# Altium schematic sheet MCU.SchDoc
size A3; SheetNumber: 3; SheetTotal: 3
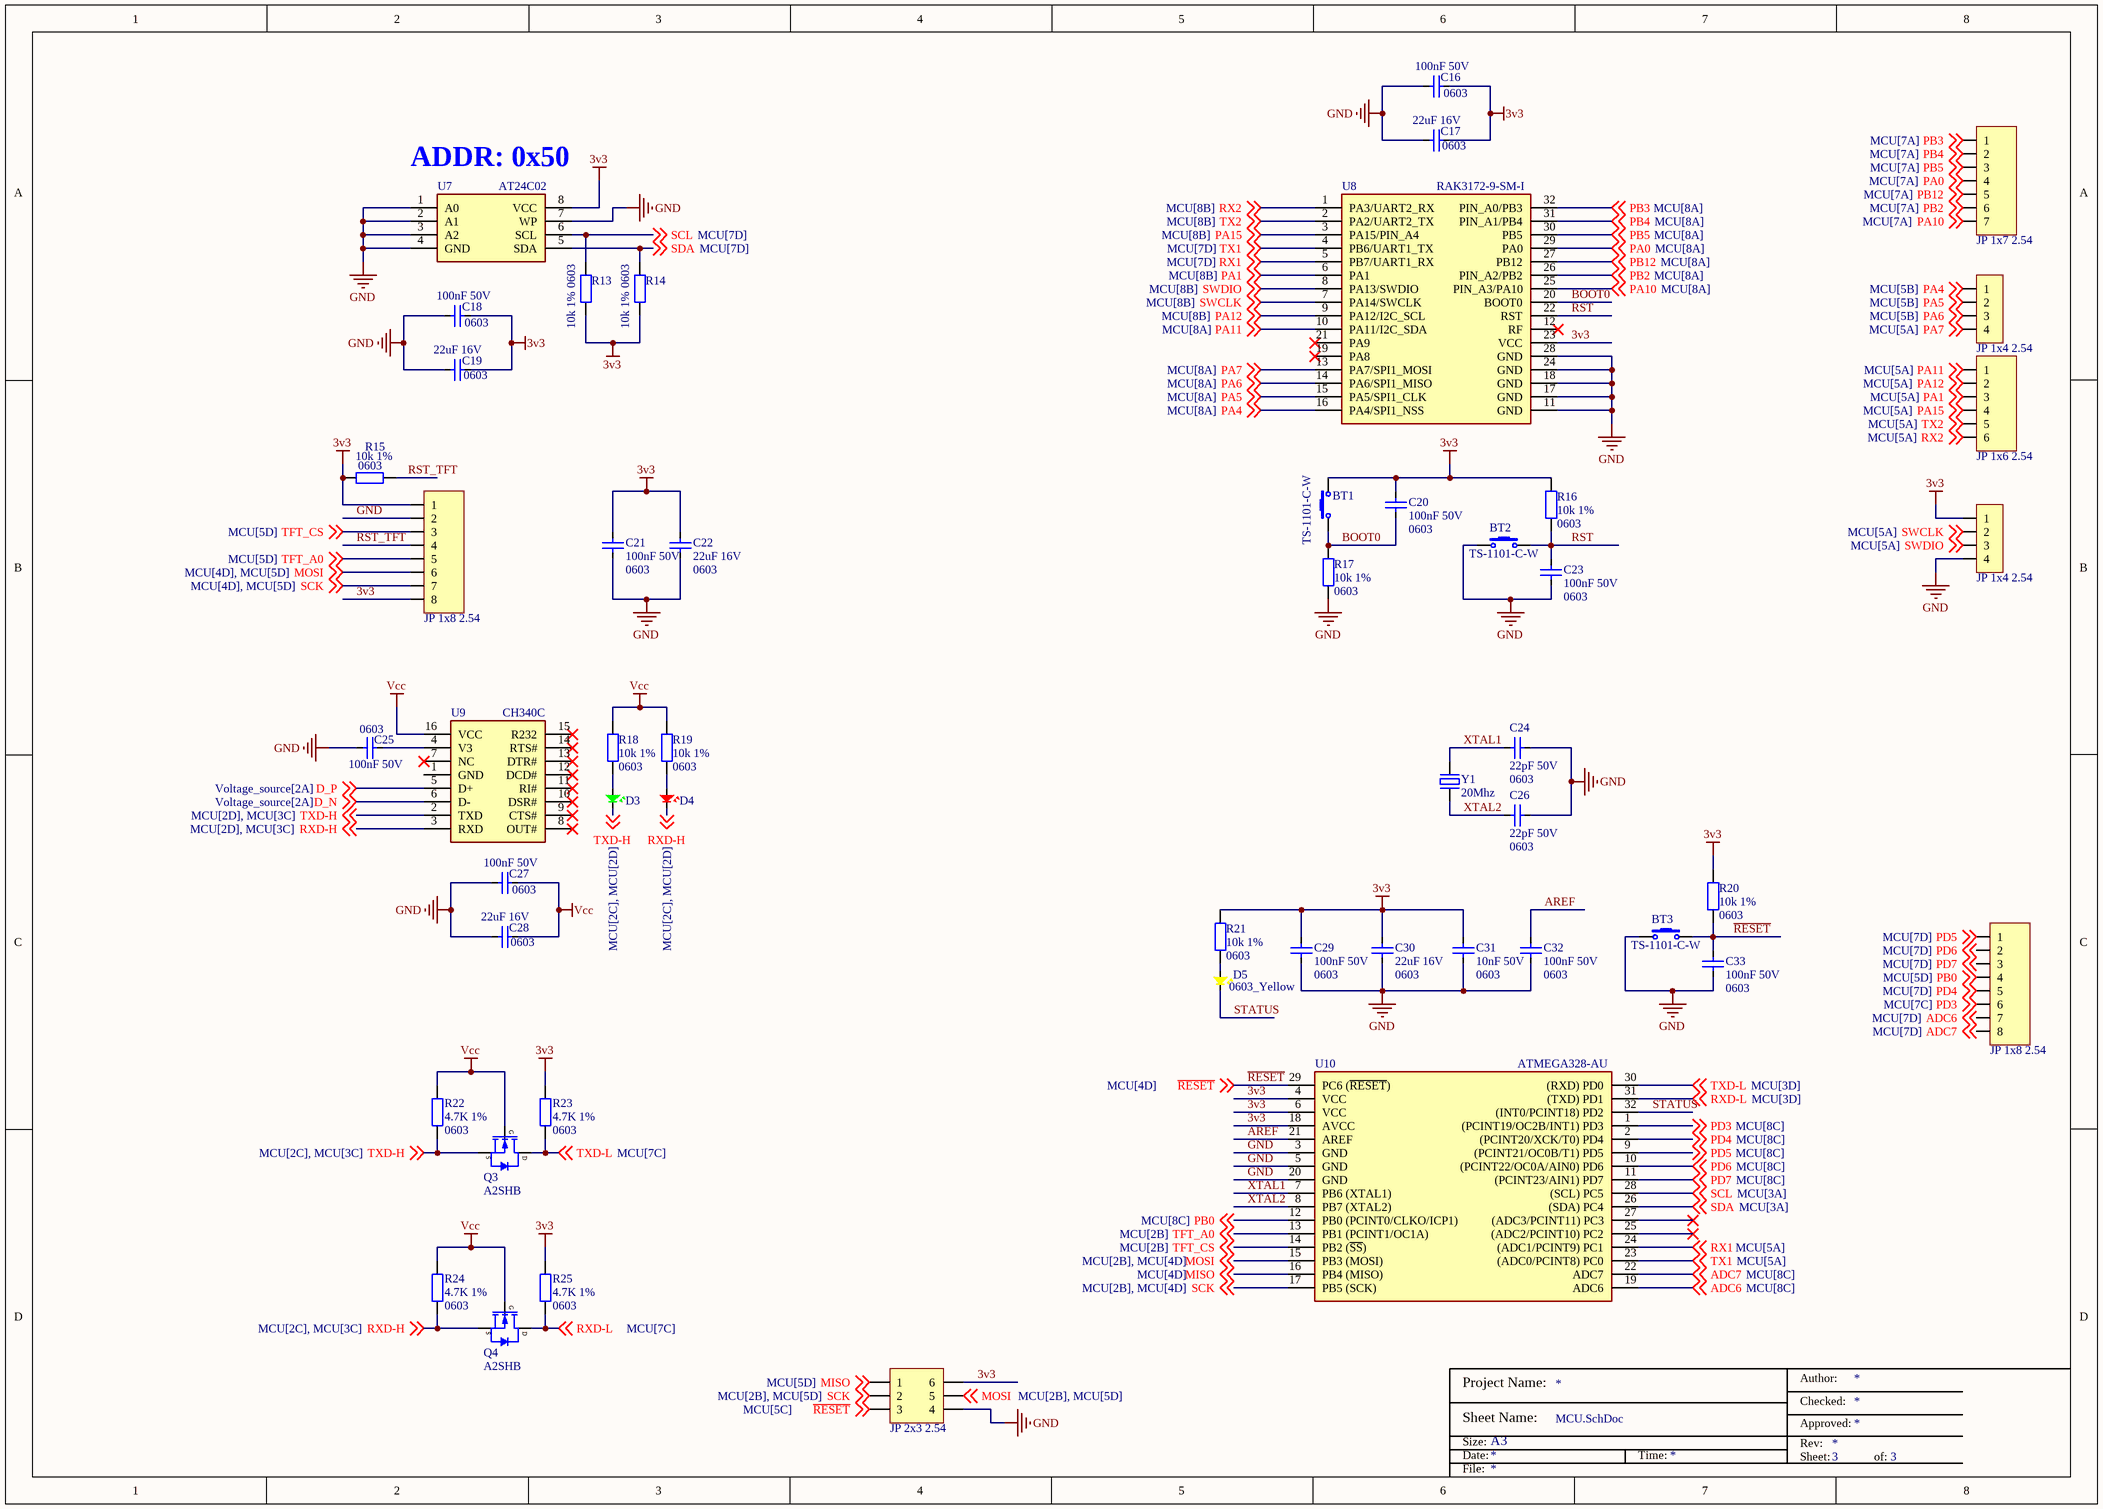
[diagram p0: MCU.SchDoc]

## Parts
BT1  TS-1101-C-W  [button-2P-SMD-6x3x2.5]
BT2  TS-1101-C-W  [button-2P-SMD-6x3x2.5]
BT3  TS-1101-C-W  [button-2P-SMD-6x3x2.5]
C16  100nF 50V  Package: 0603  [C_0603]
C17  22uF 16V  Package: 0603  [C_0603]
C18  100nF 50V  Package: 0603  [C_0603]
C19  22uF 16V  Package: 0603  [C_0603]
C20  100nF 50V  Package: 0603  [C_0603]
C21  100nF 50V  Package: 0603  [C_0603]
C22  22uF 16V  Package: 0603  [C_0603]
C23  100nF 50V  Package: 0603  [C_0603]
C24  22pF 50V  Package: 0603  [C_0603]
C25  100nF 50V  Package: 0603  [C_0603]
C26  22pF 50V  Package: 0603  [C_0603]
C27  100nF 50V  Package: 0603  [C_0603]
C28  22uF 16V  Package: 0603  [C_0603]
C29  100nF 50V  Package: 0603  [C_0603]
C30  22uF 16V  Package: 0603  [C_0603]
C31  10nF 50V  Package: 0603  [C_0603]
C32  100nF 50V  Package: 0603  [C_0603]
C33  100nF 50V  Package: 0603  [C_0603]
D3  0603 GREEN  [LED0603_GREEN]  (value not drawn)
D4  0603 RED  [LED0603_RED]  (value not drawn)
D5  0603_Yellow  [LED0603_YELLOW]
JP2  JP 1x7 2.54  [JP 1x7 CT]
JP3  JP 1x4 2.54  [JP 1x4 CT]
JP4  JP 1x6 2.54  [JP 1x6 CT]
JP5  JP 1x8 2.54  [JP 1x8 CT]
JP6  JP 1x4 2.54  [JP 1x4 CT]
JP7  JP 1x8 2.54  [JP 1x8 CT]
JP8  JP 2x3 2.54  [JP 2x3 DT]
Q3  A2SHB  [SOT23-3]
Q4  A2SHB  [SOT23-3]
R13  10k 1%  Package: 0603  [R_0603]
R14  10k 1%  Package: 0603  [R_0603]
R15  10k 1%  Package: 0603  [R_0603]
R16  10k 1%  Package: 0603  [R_0603]
R17  10k 1%  Package: 0603  [R_0603]
R18  10k 1%  Package: 0603  [R_0603]
R19  10k 1%  Package: 0603  [R_0603]
R20  10k 1%  Package: 0603  [R_0603]
R21  10k 1%  Package: 0603  [R_0603]
R22  4.7K 1%  Package: 0603  [R_0603]
R23  4.7K 1%  Package: 0603  [R_0603]
R24  4.7K 1%  Package: 0603  [R_0603]
R25  4.7K 1%  Package: 0603  [R_0603]
U7  AT24C02  [SOP-8]
U8  RAK3172-9-SM-I  [RAK3172]
U9  CH340C  [CH340C]
U10  ATMEGA328-AU  [TQFP-32(7x7)]
Y1  20Mhz  [HC-49S-SMD]

## Nets
3v3: BT1.2 C16.2 C17.1 C18.2 C19.1 C20.1 C21.2 C22.1 C29.2 C30.1 C31.2 JP5.1 JP5.8 JP6.1 JP8.6 R13.1 R14.1 R15.1 R16.2 R20.2 R21.2 R23.2 R25.2 U7.8(VCC) U8.23(VCC) U10.4(VCC) U10.6(VCC) U10.18(AVCC)
GND: BT2.1 BT3.1 C16.1 C17.2 C18.1 C19.2 C21.1 C22.2 C23.1 C24.1 C25.2 C26.1 C27.1 C28.2 C29.1 C30.2 C31.1 C32.1 C33.1 JP5.2 JP6.4 JP8.4 R17.1 U7.1(A0) U7.2(A1) U7.3(A2) U7.4(GND) U7.7(WP) U8.11(GND) U8.17(GND) U8.18(GND) U8.24(GND) U8.28(GND) U10.3(GND) U10.5(GND) U10.20(GND)
Vcc: C27.2 C28.1 Q3.1(G) Q4.1(G) R18.2 R19.2 R22.2 R24.2 U9.16(VCC)
ADC6: JP7.7 U10.19(ADC6) ; off-sheet ADC6
ADC7: JP7.8 U10.22(ADC7) ; off-sheet ADC7
AREF: C32.2 U10.21(AREF)
BOOT0: BT1.1 C20.2 R17.2 U8.20(BOOT0)
D_N: U9.6(D-) ; off-sheet D_N
D_P: U9.5(D+) ; off-sheet D_P
MISO: JP8.1 U10.16(PB4_(MISO)) ; off-sheet MISO
MOSI: JP5.6 JP8.5 U10.15(PB3_(MOSI)) ; off-sheet MOSI
PA0: JP2.4 U8.29(PA0) ; off-sheet PA0
PA1: JP4.3 U8.6(PA1) ; off-sheet PA1
PA4: JP3.1 U8.16(PA4/SPI1_NSS) ; off-sheet PA4
PA5: JP3.2 U8.15(PA5/SPI1_CLK) ; off-sheet PA5
PA6: JP3.3 U8.14(PA6/SPI1_MISO) ; off-sheet PA6
PA7: JP3.4 U8.13(PA7/SPI1_MOSI) ; off-sheet PA7
PA10: JP2.7 U8.25(PIN_A3/PA10) ; off-sheet PA10
PA11: JP4.1 U8.10(PA11/I2C_SDA) ; off-sheet PA11
PA12: JP4.2 U8.9(PA12/I2C_SCL) ; off-sheet PA12
PA15: JP4.4 U8.3(PA15/PIN_A4) ; off-sheet PA15
PB0: JP7.4 U10.12(PB0_(PCINT0/CLKO/ICP1)) ; off-sheet PB0
PB2: JP2.6 U8.26(PIN_A2/PB2) ; off-sheet PB2
PB3: JP2.1 U8.32(PIN_A0/PB3) ; off-sheet PB3
PB4: JP2.2 U8.31(PIN_A1/PB4) ; off-sheet PB4
PB5: JP2.3 U8.30(PB5) ; off-sheet PB5
PB12: JP2.5 U8.27(PB12) ; off-sheet PB12
PD3: JP7.6 U10.1((PCINT19/OC2B/INT1)_PD3) ; off-sheet PD3
PD4: JP7.5 U10.2((PCINT20/XCK/T0)_PD4) ; off-sheet PD4
PD5: JP7.1 U10.9((PCINT21/OC0B/T1)_PD5) ; off-sheet PD5
PD6: JP7.2 U10.10((PCINT22/OC0A/AIN0)_PD6) ; off-sheet PD6
PD7: JP7.3 U10.11((PCINT23/AIN1)_PD7) ; off-sheet PD7
~{RESET}: BT3.2 C33.2 JP8.3 R20.1 U10.29(PC6_(~{RESET})) ; off-sheet ~{RESET}
RST: BT2.2 C23.2 R16.1 U8.22(RST)
RST_TFT: JP5.4 R15.2
RX1: U8.5(PB7/UART1_RX) U10.24((ADC1/PCINT9)_PC1) ; off-sheet RX1
RX2: JP4.6 U8.1(PA3/UART2_RX) ; off-sheet RX2
RXD-H: D4.2 Q4.2(S) R24.1 U9.3(RXD) ; off-sheet RXD-H
RXD-L: Q4.3(D) R25.1 U10.31((TXD)_PD1) ; off-sheet RXD-L
SCK: JP5.7 JP8.2 U10.17(PB5_(SCK)) ; off-sheet SCK
SCL: R13.2 U7.6(SCL) U10.28((SCL)_PC5) ; off-sheet SCL
SDA: R14.2 U7.5(SDA) U10.26((SDA)_PC4) ; off-sheet SDA
STATUS: D5.2 U10.32((INT0/PCINT18)_PD2)
SWCLK: JP6.2 U8.7(PA14/SWCLK) ; off-sheet SWCLK
SWDIO: JP6.3 U8.8(PA13/SWDIO) ; off-sheet SWDIO
TFT_A0: JP5.5 U10.13(PB1_(PCINT1/OC1A)) ; off-sheet TFT_A0
TFT_CS: JP5.3 U10.14(PB2_(~{SS})) ; off-sheet TFT_CS
TX1: U8.4(PB6/UART1_TX) U10.23((ADC0/PCINT8)_PC0) ; off-sheet TX1
TX2: JP4.5 U8.2(PA2/UART2_TX) ; off-sheet TX2
TXD-H: D3.2 Q3.2(S) R22.1 U9.2(TXD) ; off-sheet TXD-H
TXD-L: Q3.3(D) R23.1 U10.30((RXD)_PD0) ; off-sheet TXD-L
XTAL1: C24.2 U10.7(PB6_(XTAL1)) Y1.2
XTAL2: C26.2 U10.8(PB7_(XTAL2)) Y1.1
NetC25_1: C25.1 U9.4(V3)
NetD3_1: D3.1 R18.1
NetD4_1: D4.1 R19.1
NetD5_1: D5.1 R21.1

Not connected (* = marked no-connect by the designer): U8 12(RF)* 19(PA8)* 21(PA9)*; U9 1(GND) 7(NC)* 8(OUT#)* 9(CTS#)* 10(DSR#)* 11(RI#)* 12(DCD#)* 13(DTR#)* 14(RTS#)* 15(R232)*; U10 25((ADC2/PCINT10)_PC2)* 27((ADC3/PCINT11)_PC3)*

## Notes on the sheet
- (near U7) ADDR: 0x50
- Project Name:
- Author:
- Size:
- Date:
- Sheet Name:
- A3
- Time:
- Checked:
- Approved:
- Rev:
- Sheet:
- of:
- File:

## Library data of the parts
BT1-BT3 = Button-2P: No Without Bracket 50mA 6mm 50,000 Cycles 2.6N 12V 3.6mm 2.5mm Rectangular Button Surface Mount,Vertical SPST SMD Tactile Switches ROHS; Manufacturer: XKB Connection; LCSC Part: C318938; Link: https://www.lcsc.com/product-detail/C318938.html?s_z=n_tactile%2520button; Mrf.Part: TS-1101-C-W; Package: SMD6x3.6x2.5
C16 C18 C20 C21 C23 C25 C27 C29 C32 C33 = C0603_MLCC_100nF_50V: 50V 100nF X7R ±10% 0603 Multilayer Ceramic Capacitors MLCC - SMD/SMT ROHS; Manufacturer: YAGEO; Mrf.Part: CC0603KRX7R9BB104; Packaging: Cut Tape (CT); Link: https://www.lcsc.com/product-detail/Multilayer-Ceramic-Capacitors-MLCC-SMD-SMT_YAGEO-CC0603KRX7R9BB104_C14663.html?s_z=n_100nF%2050V%200603
C17 C19 C22 C28 C30 = C0603_MLCC_22uF_16V: 16V 22uF X5R ±20% 0603 Multilayer Ceramic Capacitors MLCC - SMD/SMT ROHS; Manufacturer: Samsung Electro-Mechanics; Mrf.Part: CL10A226MO7JZNC; Packaging: Cut Tape (CT); Link: https://www.lcsc.com/product-detail/Multilayer-Ceramic-Capacitors-MLCC-SMD-SMT_Samsung-Electro-Mechanics-CL10A226MO7JZNC_C2762594.html?s_z=n_22uF%2050V%200603
C24 C26 = C0603_MLCC_22pF_50V: 50V 22pF NP0 ±5% 0603 Multilayer Ceramic Capacitors MLCC - SMD/SMT ROHS; Manufacturer: YAGEO; Mrf.Part: CC0603JRNPO9BN220; Packaging: Cut Tape (CT); Link: https://www.lcsc.com/product-detail/Multilayer-Ceramic-Capacitors-MLCC-SMD-SMT_YAGEO-CC0603JRNPO9BN220_C105620.html?s_z=n_22pF%2050V%200603
C31 = C0603_MLCC_10nF_50V: 50V 10nF X7R ±10% 0603 Multilayer Ceramic Capacitors MLCC - SMD/SMT ROHS; Manufacturer: YAGEO; Mrf.Part: CC0603KRX7R9BB103; Packaging: Cut Tape (CT); Link: https://www.lcsc.com/product-detail/Multilayer-Ceramic-Capacitors-MLCC-SMD-SMT_YAGEO-CC0603KRX7R9BB103_C100042.html?s_z=n_10nF%2050V%200603
D3 = L0603_GREEN: 225mcd~450mcd Colorless Transparent Lens -40℃~+85℃ Positive Stick 520nm~535nm Green 120° 70mW 2.4V~3V 0603 LED Indication - Discrete ROHS; Manufacturer: Amicc; Mrf.Part: A-SP192DGHC-C01-4T; Packaging: Cut Tape (CT); Link: https://www.lcsc.com/product-detail/LED-Indication-Discrete_Amicc-A-SP192DGHC-C01-4T_C19171301.html?s_z=n_LED%200603%20green; Package: 0603
D4 = L0603_RED: 20mA 330mcd Colorless Transparent Lens -20℃~+85℃ Positive Stick 620nm~630nm Red 120° 50mW 2.3V 0603 LED Indication - Discrete ROHS; Manufacturer: XINGLIGHT; Mrf.Part: XL-1608SURC-06; Packaging: Cut Tape (CT); Link: https://www.lcsc.com/product-detail/LED-Indication-Discrete_XINGLIGHT-XL-1608SURC-06_C965799.html?s_z=n_LED%200603%20red; Package: 0603
D5 = L0603_Yellow: 20mA 435mcd Water Clear 585nm~595nm op View Mount Yellow 120° 50mW 2.4V 0603 LED Indication - Discrete ROHS; Mrf.Part: XL-1608UYC-06; Manufacturer: XINGLIGHT; LCSC Part: C965802; Link: https://www.lcsc.com/product-detail/C965802.html?s_z=n_LED%25200603%2520yellow; Package: 0603; Packaging: Cut Tape
JP2 = JP 1x7 2.54 Cai Thang: Cắm; Ten_Linh_Kien: Jump Đơn Cái 2.54MM 1x20P Thẳng; Don_Vi: Con; Ma_Hang: MH004006; Ghi_Chu: *; Kieu_Chan: *; Chung_Loai: Cắm
JP3 JP6 = JP 1x4 2.54 Cai Thang: Cắm; Ten_Linh_Kien: Jump Đơn Cái 2.54MM 1x20P Thẳng; Don_Vi: Con; Ma_Hang: MH004006; Ghi_Chu: *; Kieu_Chan: *; Chung_Loai: Cắm
JP4 = JP 1x6 2.54 Cai Thang: Cắm; Ten_Linh_Kien: Jump Đơn Cái 2.54MM 1x20P Thẳng; Don_Vi: Con; Ma_Hang: MH004006; Ghi_Chu: *; Kieu_Chan: *; Chung_Loai: Cắm
JP5 JP7 = JP 1x8 2.54 Cai Thang: Cắm; Ten_Linh_Kien: Jump Đơn Cái 2.54MM 1x20P Thẳng; Don_Vi: Con; Ma_Hang: MH004006; Ghi_Chu: *; Kieu_Chan: *; Chung_Loai: Cắm
JP8 = JP 2x3 2.54 Duc Thang: Cắm; Ten_Linh_Kien: Jump Đôi Đực 2.54MM 2x40P Thẳng 11MM; Don_Vi: Con; Ma_Hang: MH002686; Ghi_Chu: *; Kieu_Chan: *; Chung_Loai: Cắm
Q3 Q4 = A2SHB: 20V 3A 900mW 60mΩ@4.5V 1V@50uA 1 N-Channel SOT-23 MOSFETs ROHS; Mrf.Part: JSM2302A-A2SHB; Manufacturer: JSMSEMI; LCSC Part: C2905536; Link: https://www.lcsc.com/product-detail/C2905536.html?s_z=n_A2SHB; Package: SOT23-3; Packaging: Cut Tape
R13-R21 = R0603_10k: 100mW Thick Film Resistor 75V ±100ppm/℃ ±1% 10kΩ 0603 Chip Resistor - Surface Mount ROHS; Mrf.Part: RC0603FR-0710KL; Manufacturer: YAGEO; LCSC Part: C98220; Link: https://www.lcsc.com/product-detail/C98220.html?s_z=n_YAgeo%25200603%252010K; Packaging: Cut Tape; Tolerance: ±1%
R22-R25 = R0603_4.7K: 4.7 kOhms ±1% 0.1W, 1/10W Chip Resistor 0603 (1608 Metric) Moisture Resistant Thick Film; Manufacturer: YAGEO; Mrf.Part: RC0603FR-074K7L; Packaging: Cut Tape (CT); Link: https://www.digikey.com/en/products/detail/yageo/RC0603FR-074K7L/727212; LCSC Part: C99782; Tolerance: ±1%
U7 = AT24C02: 2Kbit 1MHz I2C SOP-8 EEPROM ROHS; Manufacturer: HXY MOSFET; LCSC Part: C7470930; Link: https://www.lcsc.com/product-detail/C7470930.html?s_z=n_AT24C02; Mrf.Part: AT24C02; Package: SOP-8
U8 = RAK3172-9-SM-I: 15km SMD,15.5x15mm LoRa Modules ROHS, with IPEX; Manufacturer: RAKwireless; LCSC Part: C19723905; Link: https://www.lcsc.com/product-detail/C19723905.html?s_z=n_RAK3172; Mrf.Part: RAK3172-9-SM-I; Package: SMD,15.5x15mm
U9 = CH340C: 2Mbps Transceiver USB 2.0 SOP-16 USB Converters ROHS; Manufacturer: WCH; LCSC Part: C84681; Link: https://www.lcsc.com/product-detail/C84681.html?s_z=n_ch340; Mrf.Part: CH340C; Package: SOP-16
U10 = ATMEGA328-AU: AVR 20MHz TQFP-32(7x7) Microcontrollers (MCU/MPU/SOC) ROHS; Manufacturer: MICROCHIP; LCSC Part: C618731; Link: https://www.lcsc.com/product-detail/C618731.html?s_z=n_atmega328; Mrf.Part: ATMEGA328-AU; Package: TQFP-32(7x7)
Y1 = 20Mhz-2P: 20MHz Crystal Oscillator 20pF ±20ppm ±30ppm HC-49S-SMD Crystals ROHS; Mrf.Part: H6OEL89CSC-SUGYLC-20M; Manufacturer: YXC Crystal Oscillators; LCSC Part: C18213020; Link: https://www.lcsc.com/product-detail/C18213020.html?s_z=n_crystal%252020Mhz; Package: HC-49S-SMD